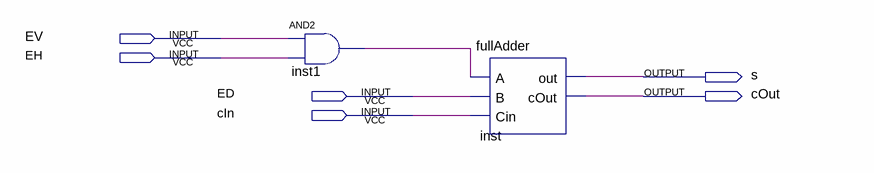
[diagram p0: schematic sheet]
// Quartus schematic mult_module.bdf as structural Verilog: 2 symbols, 6 pins
module mult_module (
  input  EV,
  input  EH,
  input  ED,
  input  cIn,
  output s,
  output cOut
);

  wire inst1_out;

  and inst1 (inst1_out, EV, EH);
  fullAdder inst (.A(inst1_out), .B(ED), .Cin(cIn), .out(s), .cOut(cOut));
endmodule
